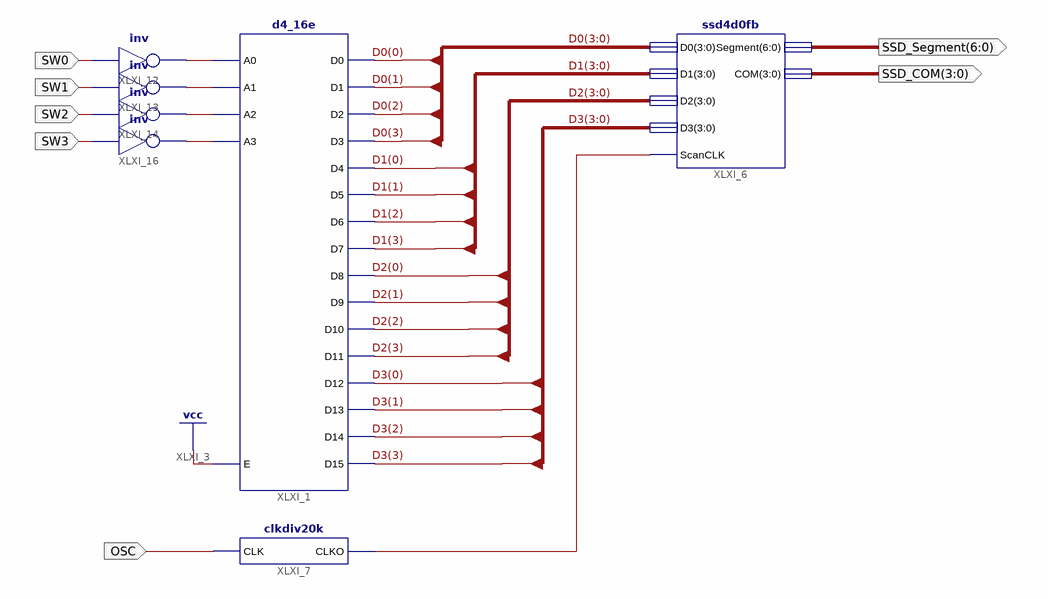
[diagram p0: schematic sheet 1]
// Xilinx ISE schematic main.sch (spartan6) as structural Verilog: 7 symbols, 7 ports
module main (
  input  OSC,
  input  SW3,
  input  SW2,
  input  SW1,
  input  SW0,
  output [3:0] SSD_COM,
  output [6:0] SSD_Segment
);

  wire SW0i, SW1i, SW2i, SW3i, XLXN_41;
  wire [3:0] D0, D1, D2, D3;

  d4_16e XLXI_1 (
    .A0(SW0i), .A1(SW1i), .A2(SW2i), .A3(SW3i), .E(1'b1), .D0(D0[0]), .D1(D0[1]), .D10(D2[2]), .D11(D2[3]),
    .D12(D3[0]), .D13(D3[1]), .D14(D3[2]), .D15(D3[3]), .D2(D0[2]), .D3(D0[3]), .D4(D1[0]), .D5(D1[1]),
    .D6(D1[2]), .D7(D1[3]), .D8(D2[0]), .D9(D2[1]));
  ssd4d0fb XLXI_6 (.COM(SSD_COM), .D0(D0), .D1(D1), .D2(D2), .D3(D3), .ScanCLK(XLXN_41), .Segment(SSD_Segment));
  clkdiv20k XLXI_7 (.CLK(OSC), .CLKO(XLXN_41));
  not XLXI_16 (SW3i, SW3);
  not XLXI_14 (SW2i, SW2);
  not XLXI_13 (SW1i, SW1);
  not XLXI_12 (SW0i, SW0);
endmodule
